# Altium schematic sheet DC_MotorDriver_2Channel.SchDoc
size A3
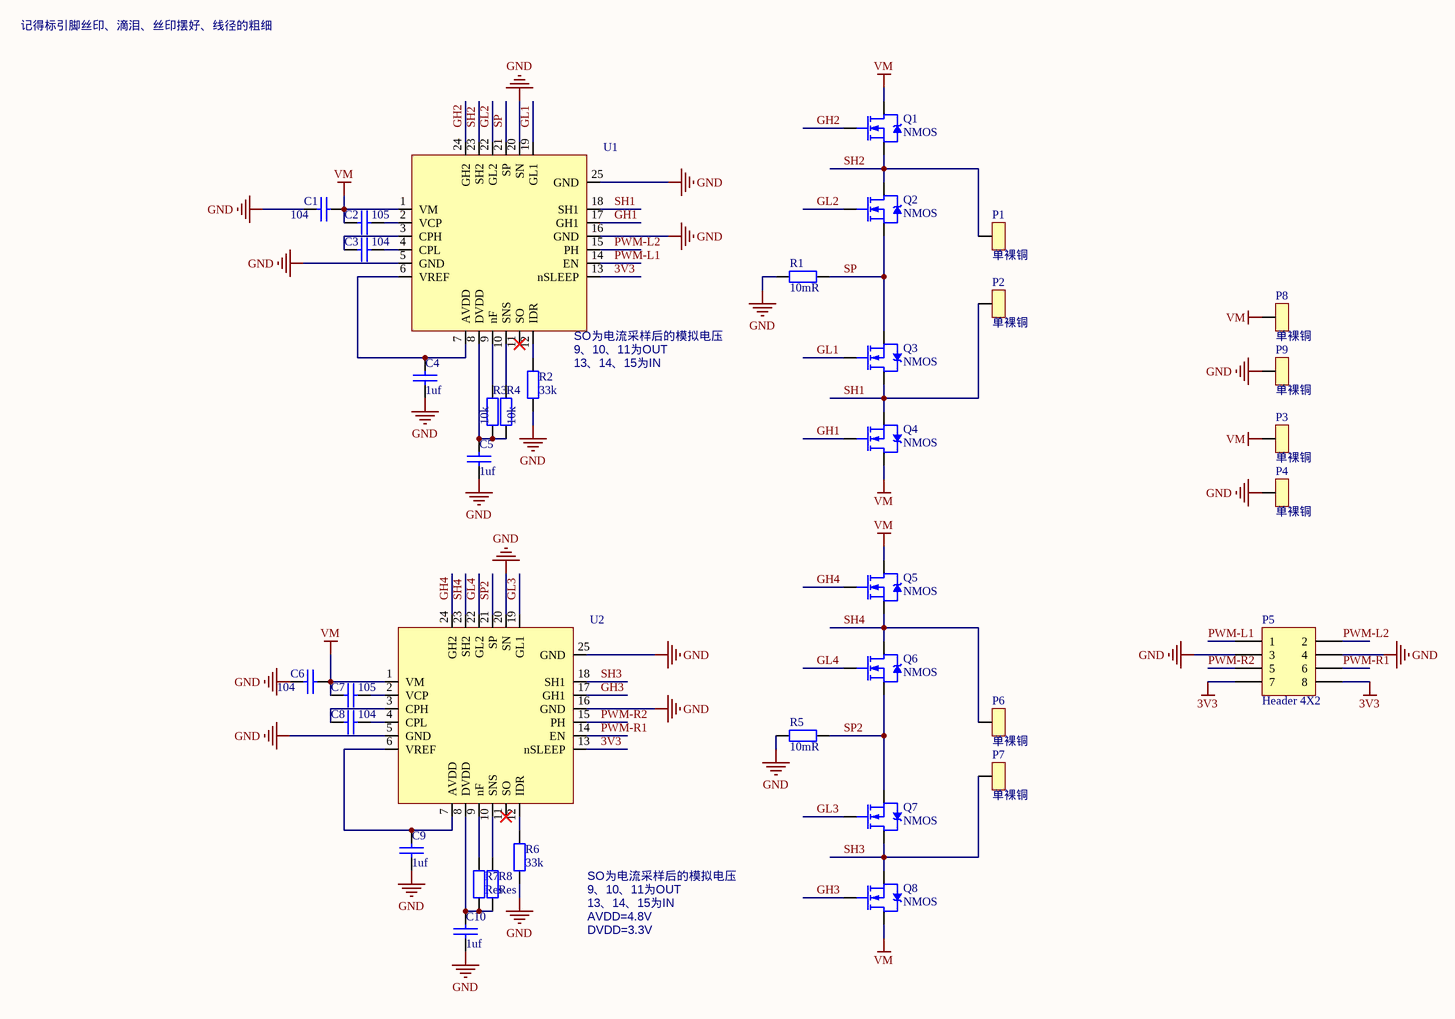
[diagram p0: DC_MotorDriver_2Channel.SchDoc]

## Parts
C1  104  [0603C]
C2  105  [0603C]
C3  104  [0603C]
C4  1uf  [0603C]
C5  1uf  [0603C]
C6  104  [0603C]
C7  105  [0603C]
C8  104  [0603C]
C9  1uf  [0603C]
C10  1uf  [0603C]
P1  单裸铜  [裸铜2*5]
P2  单裸铜  [裸铜2*5]
P3  单裸铜  [裸铜2*5]
P4  单裸铜  [裸铜2*5]
P5  Header 4X2  [HDR2X4]
P6  单裸铜  [裸铜2*5]
P7  单裸铜  [裸铜2*5]
P8  单裸铜  [裸铜2*5]
P9  单裸铜  [裸铜2*5]
Q1  NMOS  [DNF5X6]
Q2  NMOS  [DNF5X6]
Q3  NMOS  [DNF5X6]
Q4  NMOS  [DNF5X6]
Q5  NMOS  [DNF5X6]
Q6  NMOS  [DNF5X6]
Q7  NMOS  [DNF5X6]
Q8  NMOS  [DNF5X6]
R1  10mR  [1206R]
R2  33k  [0603R]
R3  10k  [0603R]
R4  10k  [0603R]
R5  10mR  [1206R]
R6  33k  [0603R]
R7  Res  [0603R]
R8  Res  [0603R]
U1  DRV8701  [QFN24]  (value not drawn)
U2  DRV8701  [QFN24]  (value not drawn)

## Nets
3V3: P5.7 P5.8 U1.13(nSLEEP) U2.13(nSLEEP)
GND: C1.1 C4.1 C5.1 C6.1 C9.1 C10.1 P4.1 P5.3 P5.4 P9.1 R1.2 R2.2 R5.2 R6.2 U1.5(GND) U1.16(GND) U1.20(SN) U1.25(GND) U2.5(GND) U2.16(GND) U2.20(SN) U2.25(GND)
VM: C1.2 C2.1 C6.2 C7.1 P3.1 P8.1 Q1.2(D) Q4.2(D) Q5.2(D) Q8.2(D) U1.1(VM) U2.1(VM)
GH1: Q4.1(G) U1.17(GH1)
GH2: Q1.1(G) U1.24(GH2)
GH3: Q8.1(G) U2.17(GH1)
GH4: Q5.1(G) U2.24(GH2)
GL1: Q3.1(G) U1.19(GL1)
GL2: Q2.1(G) U1.22(GL2)
GL3: Q7.1(G) U2.19(GL1)
GL4: Q6.1(G) U2.22(GL2)
PWM-L1: P5.1 U1.14(EN)
PWM-L2: P5.2 U1.15(PH)
PWM-R1: P5.6 U2.14(EN)
PWM-R2: P5.5 U2.15(PH)
SH1: P2.1 Q3.2(D) Q4.3(S) U1.18(SH1)
SH2: P1.1 Q1.3(S) Q2.2(D) U1.23(SH2)
SH3: P7.1 Q7.2(D) Q8.3(S) U2.18(SH1)
SH4: P6.1 Q5.3(S) Q6.2(D) U2.23(SH2)
SP: Q2.3(S) Q3.3(S) R1.1 U1.21(SP)
SP2: Q6.3(S) Q7.3(S) R5.1 U2.21(SP)
NetC2_2: C2.2 U1.2(VCP)
NetC3_1: C3.1 U1.3(CPH)
NetC3_2: C3.2 U1.4(CPL)
NetC4_2: C4.2 U1.6(VREF) U1.7(AVDD)
NetC5_2: C5.2 R3.2 R4.2 U1.8(DVDD)
NetC7_2: C7.2 U2.2(VCP)
NetC8_1: C8.1 U2.3(CPH)
NetC8_2: C8.2 U2.4(CPL)
NetC9_2: C9.2 U2.6(VREF) U2.7(AVDD)
NetC10_2: C10.2 R7.2 R8.2 U2.8(DVDD)
NetR2_1: R2.1 U1.12(IDR)
NetR3_1: R3.1 U1.9(nF)
NetR4_1: R4.1 U1.10(SNS)
NetR6_1: R6.1 U2.12(IDR)
NetR7_1: R7.1 U2.9(nF)
NetR8_1: R8.1 U2.10(SNS)

Not connected (* = marked no-connect by the designer): U1 11(SO)*; U2 11(SO)*

## Notes on the sheet
- 记得标引脚丝印、滴泪、丝印摆好、线径的粗细
- (near U1) SO为电流采样后的模拟电压
- (near U1) 9、10、11为OUT
- 13、14、15为IN
- SO为电流采样后的模拟电压
- 9、10、11为OUT
- AVDD=4.8V
- DVDD=3.3V

## Library data of the parts
C1-C10 = CAP: Capacitor
P5 = Header 4X2: Header, 4-Pin, Dual row; LatestRevisionDate: 17-Jul-2002; LatestRevisionNote: Re-released for DXP Platform.; Publisher: Altium Limited
R1-R8 = Res: Resistor